# Altium schematic sheet FPGA.SchDoc
size A
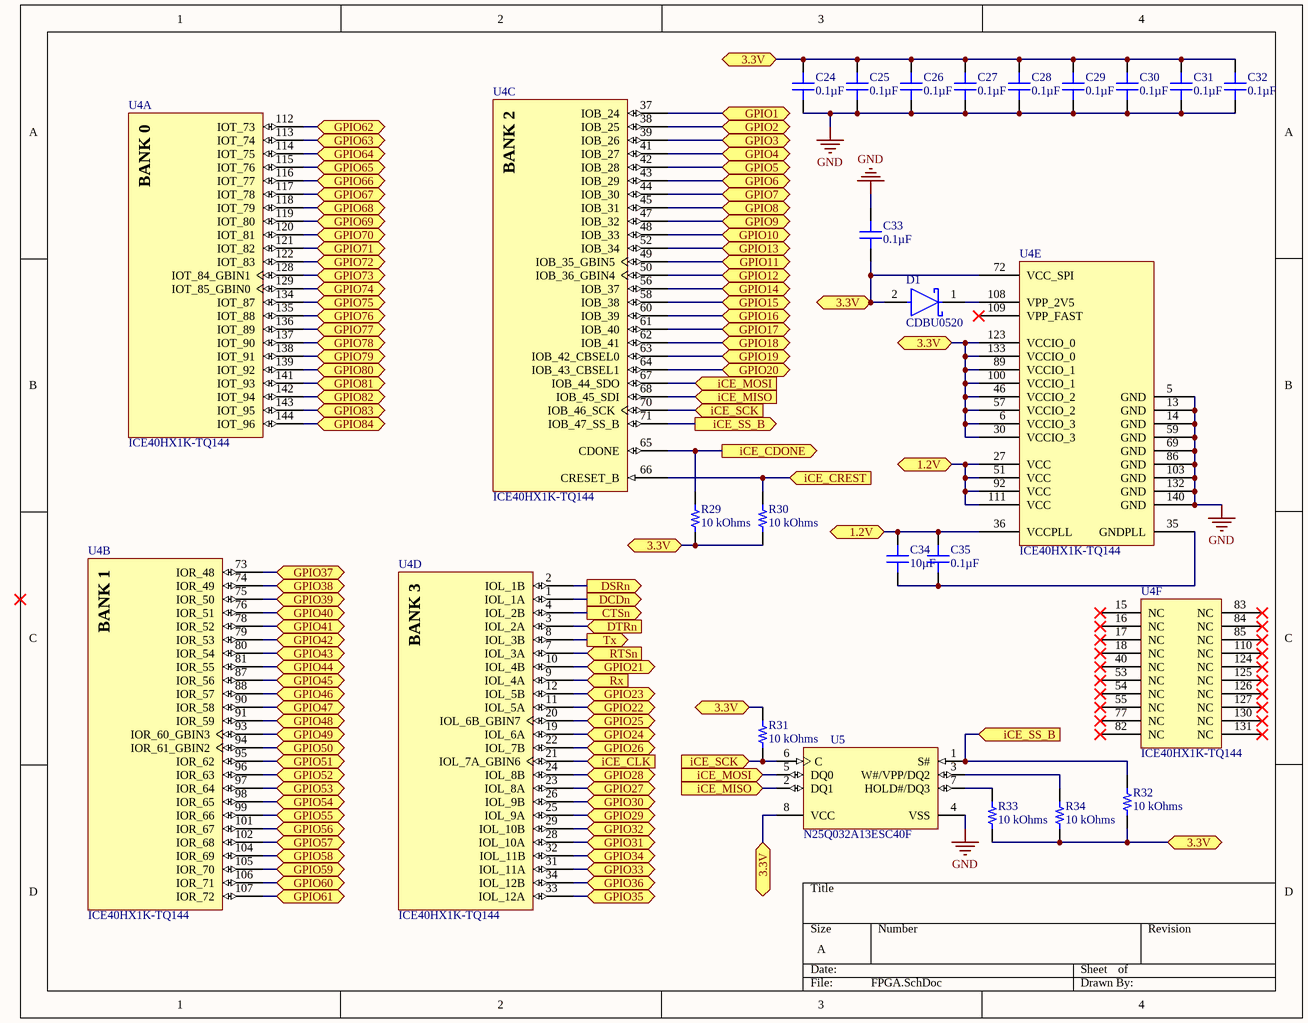
[diagram p0: FPGA.SchDoc]

## Parts
C24  0.1µF  [CAP 0805_2012]
C25  0.1µF  [CAP 0805_2012]
C26  0.1µF  [CAP 0805_2012]
C27  0.1µF  [CAP 0805_2012]
C28  0.1µF  [CAP 0805_2012]
C29  0.1µF  [CAP 0805_2012]
C30  0.1µF  [CAP 0805_2012]
C31  0.1µF  [CAP 0805_2012]
C32  0.1µF  [CAP 0805_2012]
C33  0.1µF  [CAP 0805_2012]
C34  10µF  [CAP 0805_2012]
C35  0.1µF  [CAP 0805_2012]
D1  CDBU0520  [FP-0603-SOD-523F-MFG]
R29  10 kOhms  [RES 0805_2012]
R30  10 kOhms  [RES 0805_2012]
R31  10 kOhms  [RES 0805_2012]
R32  10 kOhms  [RES 0805_2012]
R33  10 kOhms  [RES 0805_2012]
R34  10 kOhms  [RES 0805_2012]
U4  ICE40HX1K-TQ144  [LATC-TQFP-144_L]  (parts A,B,C,D,E,F of 6)
U5  N25Q032A13ESC40F  [MICT-SC-8_N]

## Ports
1.2V (bidir), 3.3V (bidir), CTSn (out), DCDn (out), DSRn (out), DTRn (in), GPIO1 (bidir), GPIO2 (bidir), GPIO3 (bidir), GPIO4 (bidir), GPIO5 (bidir), GPIO6 (bidir), GPIO7 (bidir), GPIO8 (bidir), GPIO9 (bidir), GPIO10 (bidir), GPIO11 (bidir), GPIO12 (bidir), GPIO13 (bidir), GPIO14 (bidir), GPIO15 (bidir), GPIO16 (bidir), GPIO17 (bidir), GPIO18 (bidir), GPIO19 (bidir), GPIO20 (bidir), GPIO21 (bidir), GPIO22 (bidir), GPIO23 (bidir), GPIO24 (bidir), GPIO25 (bidir), GPIO26 (bidir), GPIO27 (bidir), GPIO28 (bidir), GPIO29 (bidir), GPIO30 (bidir), GPIO31 (bidir), GPIO32 (bidir), GPIO33 (bidir), GPIO34 (bidir), GPIO35 (bidir), GPIO36 (bidir), GPIO37 (bidir), GPIO38 (bidir), GPIO39 (bidir), GPIO40 (bidir), GPIO41 (bidir), GPIO42 (bidir), GPIO43 (bidir), GPIO44 (bidir), GPIO45 (bidir), GPIO46 (bidir), GPIO47 (bidir), GPIO48 (bidir), GPIO49 (bidir), GPIO50 (bidir), GPIO51 (bidir), GPIO52 (bidir), GPIO53 (bidir), GPIO54 (bidir), GPIO55 (bidir), GPIO56 (bidir), GPIO57 (bidir), GPIO58 (bidir), GPIO59 (bidir), GPIO60 (bidir), GPIO61 (bidir), GPIO62 (bidir), GPIO63 (bidir), GPIO64 (bidir), GPIO65 (bidir), GPIO66 (bidir), GPIO67 (bidir), GPIO68 (bidir), GPIO69 (bidir), GPIO70 (bidir), GPIO71 (bidir), GPIO72 (bidir), GPIO73 (bidir), GPIO74 (bidir), GPIO75 (bidir), GPIO76 (bidir), GPIO77 (bidir), GPIO78 (bidir), GPIO79 (bidir), GPIO80 (bidir), GPIO81 (bidir), GPIO82 (bidir), GPIO83 (bidir), GPIO84 (bidir), iCE_CDONE (out), iCE_CLK (in), iCE_CREST (in), iCE_MISO (in), iCE_MOSI (in), iCE_SCK (in), iCE_SS_B (in), iCE_SS_B (out), RTSn (in), Rx (in), Tx (out)

## Nets
GND: C24.1 C25.1 C26.1 C27.1 C28.1 C29.1 C30.1 C31.1 C32.1 C33.2 U4.5(GND) U4.13(GND) U4.14(GND) U4.59(GND) U4.69(GND) U4.86(GND) U4.103(GND) U4.132(GND) U4.140(GND) U5.4(VSS)
1.2V: C34.2 C35.2 U4.27(VCC) U4.36(VCCPLL) U4.51(VCC) U4.92(VCC) U4.111(VCC) ; port 1.2V
3.3V: C24.2 C25.2 C26.2 C27.2 C28.2 C29.2 C30.2 C31.2 C32.2 C33.1 D1.2(A) R29.2 R30.2 R31.2 R32.1 R33.1 R34.1 U4.6(VCCIO_3) U4.30(VCCIO_3) U4.46(VCCIO_2) U4.57(VCCIO_2) U4.72(VCC_SPI) U4.89(VCCIO_1) U4.100(VCCIO_1) U4.123(VCCIO_0) U4.133(VCCIO_0) U5.8(VCC) ; port 3.3V
CTSn: U4.4(IOL_2B) ; port CTSn
DCDn: U4.1(IOL_1A) ; port DCDn
DSRn: U4.2(IOL_1B) ; port DSRn
DTRn: U4.3(IOL_2A) ; port DTRn
GPIO1: U4.37(IOB_24) ; port GPIO1
GPIO2: U4.38(IOB_25) ; port GPIO2
GPIO3: U4.39(IOB_26) ; port GPIO3
GPIO4: U4.41(IOB_27) ; port GPIO4
GPIO5: U4.42(IOB_28) ; port GPIO5
GPIO6: U4.43(IOB_29) ; port GPIO6
GPIO7: U4.44(IOB_30) ; port GPIO7
GPIO8: U4.45(IOB_31) ; port GPIO8
GPIO9: U4.47(IOB_32) ; port GPIO9
GPIO10: U4.48(IOB_33) ; port GPIO10
GPIO11: U4.49(IOB_35_GBIN5) ; port GPIO11
GPIO12: U4.50(IOB_36_GBIN4) ; port GPIO12
GPIO13: U4.52(IOB_34) ; port GPIO13
GPIO14: U4.56(IOB_37) ; port GPIO14
GPIO15: U4.58(IOB_38) ; port GPIO15
GPIO16: U4.60(IOB_39) ; port GPIO16
GPIO17: U4.61(IOB_40) ; port GPIO17
GPIO18: U4.62(IOB_41) ; port GPIO18
GPIO19: U4.63(IOB_42_CBSEL0) ; port GPIO19
GPIO20: U4.64(IOB_43_CBSEL1) ; port GPIO20
GPIO21: U4.10(IOL_4B) ; port GPIO21
GPIO22: U4.11(IOL_5A) ; port GPIO22
GPIO23: U4.12(IOL_5B) ; port GPIO23
GPIO24: U4.19(IOL_6A) ; port GPIO24
GPIO25: U4.20(IOL_6B_GBIN7) ; port GPIO25
GPIO26: U4.22(IOL_7B) ; port GPIO26
GPIO27: U4.23(IOL_8A) ; port GPIO27
GPIO28: U4.24(IOL_8B) ; port GPIO28
GPIO29: U4.25(IOL_9A) ; port GPIO29
GPIO30: U4.26(IOL_9B) ; port GPIO30
GPIO31: U4.28(IOL_10A) ; port GPIO31
GPIO32: U4.29(IOL_10B) ; port GPIO32
GPIO33: U4.31(IOL_11A) ; port GPIO33
GPIO34: U4.32(IOL_11B) ; port GPIO34
GPIO35: U4.33(IOL_12A) ; port GPIO35
GPIO36: U4.34(IOL_12B) ; port GPIO36
GPIO37: U4.73(IOR_48) ; port GPIO37
GPIO38: U4.74(IOR_49) ; port GPIO38
GPIO39: U4.75(IOR_50) ; port GPIO39
GPIO40: U4.76(IOR_51) ; port GPIO40
GPIO41: U4.78(IOR_52) ; port GPIO41
GPIO42: U4.79(IOR_53) ; port GPIO42
GPIO43: U4.80(IOR_54) ; port GPIO43
GPIO44: U4.81(IOR_55) ; port GPIO44
GPIO45: U4.87(IOR_56) ; port GPIO45
GPIO46: U4.88(IOR_57) ; port GPIO46
GPIO47: U4.90(IOR_58) ; port GPIO47
GPIO48: U4.91(IOR_59) ; port GPIO48
GPIO49: U4.93(IOR_60_GBIN3) ; port GPIO49
GPIO50: U4.94(IOR_61_GBIN2) ; port GPIO50
GPIO51: U4.95(IOR_62) ; port GPIO51
GPIO52: U4.96(IOR_63) ; port GPIO52
GPIO53: U4.97(IOR_64) ; port GPIO53
GPIO54: U4.98(IOR_65) ; port GPIO54
GPIO55: U4.99(IOR_66) ; port GPIO55
GPIO56: U4.101(IOR_67) ; port GPIO56
GPIO57: U4.102(IOR_68) ; port GPIO57
GPIO58: U4.104(IOR_69) ; port GPIO58
GPIO59: U4.105(IOR_70) ; port GPIO59
GPIO60: U4.106(IOR_71) ; port GPIO60
GPIO61: U4.107(IOR_72) ; port GPIO61
GPIO62: U4.112(IOT_73) ; port GPIO62
GPIO63: U4.113(IOT_74) ; port GPIO63
GPIO64: U4.114(IOT_75) ; port GPIO64
GPIO65: U4.115(IOT_76) ; port GPIO65
GPIO66: U4.116(IOT_77) ; port GPIO66
GPIO67: U4.117(IOT_78) ; port GPIO67
GPIO68: U4.118(IOT_79) ; port GPIO68
GPIO69: U4.119(IOT_80) ; port GPIO69
GPIO70: U4.120(IOT_81) ; port GPIO70
GPIO71: U4.121(IOT_82) ; port GPIO71
GPIO72: U4.122(IOT_83) ; port GPIO72
GPIO73: U4.128(IOT_84_GBIN1) ; port GPIO73
GPIO74: U4.129(IOT_85_GBIN0) ; port GPIO74
GPIO75: U4.134(IOT_87) ; port GPIO75
GPIO76: U4.135(IOT_88) ; port GPIO76
GPIO77: U4.136(IOT_89) ; port GPIO77
GPIO78: U4.137(IOT_90) ; port GPIO78
GPIO79: U4.138(IOT_91) ; port GPIO79
GPIO80: U4.139(IOT_92) ; port GPIO80
GPIO81: U4.141(IOT_93) ; port GPIO81
GPIO82: U4.142(IOT_94) ; port GPIO82
GPIO83: U4.143(IOT_95) ; port GPIO83
GPIO84: U4.144(IOT_96) ; port GPIO84
iCE_CDONE: R29.1 U4.65(CDONE) ; port iCE_CDONE
iCE_CLK: U4.21(IOL_7A_GBIN6) ; port iCE_CLK
iCE_CREST: R30.1 U4.66(CRESET_B) ; port iCE_CREST
iCE_MISO: U4.68(IOB_45_SDI) U5.2(DQ1) ; port iCE_MISO
iCE_MOSI: U4.67(IOB_44_SDO) U5.5(DQ0) ; port iCE_MOSI
iCE_SCK: R31.1 U4.70(IOB_46_SCK) U5.6(C) ; port iCE_SCK
iCE_SS_B: R32.2 U4.71(IOB_47_SS_B) U5.1(S#) ; port iCE_SS_B
RTSn: U4.7(IOL_3A) ; port RTSn
Rx: U4.9(IOL_4A) ; port Rx
Tx: U4.8(IOL_3B) ; port Tx
NetC34_1: C34.1 C35.1 U4.35(GNDPLL)
NetD1_1: D1.1(C) U4.108(VPP_2V5)
NetR33_2: R33.2 U5.7(HOLD#/DQ3)
NetR34_2: R34.2 U5.3(W#/VPP/DQ2)

Not connected (* = marked no-connect by the designer): U4 15(NC)* 16(NC)* 17(NC)* 18(NC)* 40(NC)* 53(NC)* 54(NC)* 55(NC)* 77(NC)* 82(NC)* 83(NC)* 84(NC)* 85(NC)* 109(VPP_FAST)* 110(NC)* 124(NC)* 125(NC)* 126(NC)* 127(NC)* 130(NC)* 131(NC)*

## Notes on the sheet
- (in symbol CMP-0962-00009-1, part A) BANK 0
- (in symbol CMP-0962-00009-1, part B) BANK 1
- (in symbol CMP-0962-00009-1, part C) BANK 2
- (in symbol CMP-0962-00009-1, part D) BANK 3

## Library data of the parts
C24-C33 C35 = CL21B104KBCNNNC: CAP CER 0.1UF 50V X7R 0805; Manufacturer: Samsung Electro-Mechanics; Tolerance: ±10%; Part Number: CL21B104KBCNNNC; Value: 0.1µF; Applications: General Purpose; Capacitance: 0.1µF; ComponentLink1Description: Datasheet; ComponentLink1URL: http://www.samsungsem.com/kr/support/product-search/mlcc/CL21B104KBCNNNC.jsp; ComponentLink2Description: DigiKey Link; ComponentLink2URL: http://digikey.com/product-detail/en/samsung-electro-mechanics/CL21B104KBCNNNC/1276-1003-1-ND/3889089; Device Package: 0805 (2012 Metric); LastUpdated: 9/2/2020 1:04:35 AM; Lifecycle Status: Active; Minimum Order: 1; Mounting Type: Surface Mount, MLCC; Operating Temperature: -55°C ~ 125°C; Package / Case: 0805 (2012 Metric); Packaging: TapeAndReel; PartId: 6201; Part Status: Active; Price: 0.01; Series: CL; Size / Dimension: 0.079" L x 0.049" W (2.00mm x 1.25mm); Supplier 1: DigiKey; Supplier Part Number 1: 1276-1003-1-ND; Temperature Coefficient: X7R; Thickness (Max): 0.037" (0.95mm); Voltage - Rated: 50V
C34 = CL21A106KOQNNNG: CAP CER 10UF 16V X5R 0805; Manufacturer: Samsung Electro-Mechanics; Tolerance: ±10%; Part Number: CL21A106KOQNNNG; Value: 10µF; Applications: General Purpose; Capacitance: 10µF; ComponentLink1Description: Datasheet; ComponentLink1URL: http://www.samsungsem.com/kr/support/product-search/mlcc/CL21A106KOQNNNG.jsp; ComponentLink2Description: DigiKey Link; ComponentLink2URL: http://digikey.com/product-detail/en/samsung-electro-mechanics/CL21A106KOQNNNG/1276-6455-1-ND/5958083; Device Package: 0805 (2012 Metric); LastUpdated: 9/2/2020 1:04:35 AM; Lifecycle Status: Active; Minimum Order: 1; Mounting Type: Surface Mount, MLCC; Operating Temperature: -55°C ~ 85°C; Package / Case: 0805 (2012 Metric); Packaging: TapeAndReel; PartId: 6236; Part Status: Active; Price: 0.02; Series: CL; Size / Dimension: 0.079" L x 0.049" W (2.00mm x 1.25mm); Supplier 1: DigiKey; Supplier Part Number 1: 1276-6455-1-ND; Temperature Coefficient: X5R; Thickness (Max): 0.055" (1.40mm); Voltage - Rated: 16V
D1 = CMP-20227-000003-1: DIODE SCHOTTKY 20V 500MA 0603; Max Surge Current: 2A; Max Reverse Leakage Current: 100uA; Package Quantity: 1; Packaging: Tape and Reel; Mount: Surface Mount; Max Reverse Voltage (DC): 20V; Average Rectified Current: 500mA; Case/Package: SMD/SMT
R29-R34 = RNCP0805FTD10K0: RES 10K OHM 1% 1/4W 0805; Manufacturer: Stackpole Electronics Inc; Power (Watts): 0.25W, 1/4W; Temperature Coefficient: ±100ppm/°C; Part Number: RNCP0805FTD10K0; Value: 10 kOhms; ComponentLink1Description: Datasheet; ComponentLink1URL: https://www.seielect.com/catalog/sei-rncp.pdf; ComponentLink2Description: DigiKey Link; ComponentLink2URL: http://digikey.com/product-detail/en/stackpole-electronics-inc/RNCP0805FTD10K0/RNCP0805FTD10K0CT-ND/2240601; Composition: Thin Film; Device Package: 0805 (2012 Metric); Features: Anti-Sulfur, Moisture Resistant; Height - Seated (Max): 0.024" (0.60mm); LastUpdated: 9/2/2020 1:15:23 AM; Lifecycle Status: Active; Minimum Order: 1; Number of Terminations: 2; Operating Temperature: -55°C ~ 155°C; Package / Case: 0805 (2012 Metric); Packaging: TapeAndReel; PartId: 28021; Part Status: Active; Price: 0.01; Resistance: 10 kOhms; Series: RNCP; Size / Dimension: 0.079" L x 0.049" W (2.00mm x 1.25mm); Supplier 1: DigiKey; Supplier Part Number 1: RNCP0805FTD10K0CT-ND; Supplier Device Package: 0805; Tolerance: ±1%
U4 = CMP-0962-00009-1: iCE40 HX1K Series FPGA Family, 1280 Logic Cells, 1.2 V Core, 64 K Embedded RAM Bits, 144-pin TQFP, Pb-Free, Tray; Manufacturer: Lattice Semiconductor; Embedded RAM Bits: 64K; Logic Cells: 1280; Phase-Locked Loops: 1; Supply Voltage: 1.2V; Mounting Technology: Surface Mount; ComponentLink3URL: http://www.latticesemi.com/lit/docs/package/pkg.pdf; ComponentLink1URL: http://www.latticesemi.com/en; ComponentLink2Description: Datasheet; RoHS: TRUE; ComponentLink2URL: http://www.latticesemi.com/~/media/Documents/DataSheets/iCE/iCE40LPHXFamilyDataSheet.pdf; PackageVersion: Rev. 03.9, 02/2013; ComponentLink1Description: Manufacturer URL; PartNumber: ICE40HX1K-TQ144; DatasheetVersion: Rev. 02.9; PackageReference: TQFP-144; PackageDescription: 144-Pin Thin Quad Flat Package, Body 20 x 20 mm, Pitch 0.5 mm; Packing: Tray; ComponentLink3Description: Package Specification
U5 = CMP-0357-00152-1: 32 Mb (x1/x2/x4) Serial NOR Flash Memory with Multi I/O, 108 MHz, 2.7 to 3.6 V, 8-pin SO8 Narrow (SC), Tape & Reel; Manufacturer: Micron; Part Family: N25QÂ; Density: 32MbÂ; Speed: 108 MHzÂ; Voltage: 2.7V-3.6VÂ; PackageReference: MICT-SC-8; Width: x1/x2/x4Â; Mounting Technology: Surface Mount; ComponentLink2Description: Datasheet; PackageVersion: Rev. E; ComponentLink1Description: Manufacturer URL; PackageDescription: 8-Pin SO Narrow, 3.9 X 4.9 mm, Pitch 1.27 mm; ComponentLink2URL: http://www.micron.com/~/media/Documents/Products/Data%20Sheet/NOR%20Flash/Serial%20NOR/N25Q/n25q_32mb_3v_65nm.pdf; Part Status: ProductionÂ; Applications: EmbeddedÂ; ComponentLink1URL: http://www.micron.com/; PartNumber: N25Q032A13ESC40F; ComponentLink3Description: Package Specification; ComponentLink3URL: http://www.micron.com/~/media/Documents/Products/Data%20Sheet/NOR%20Flash/Serial%20NOR/N25Q/n25q_32mb_3v_65nm.pdf; Package: SO8 NarrowÂ; Type: Multi I/OÂ; DatasheetVersion: Rev. G; RoHS: YesÂ